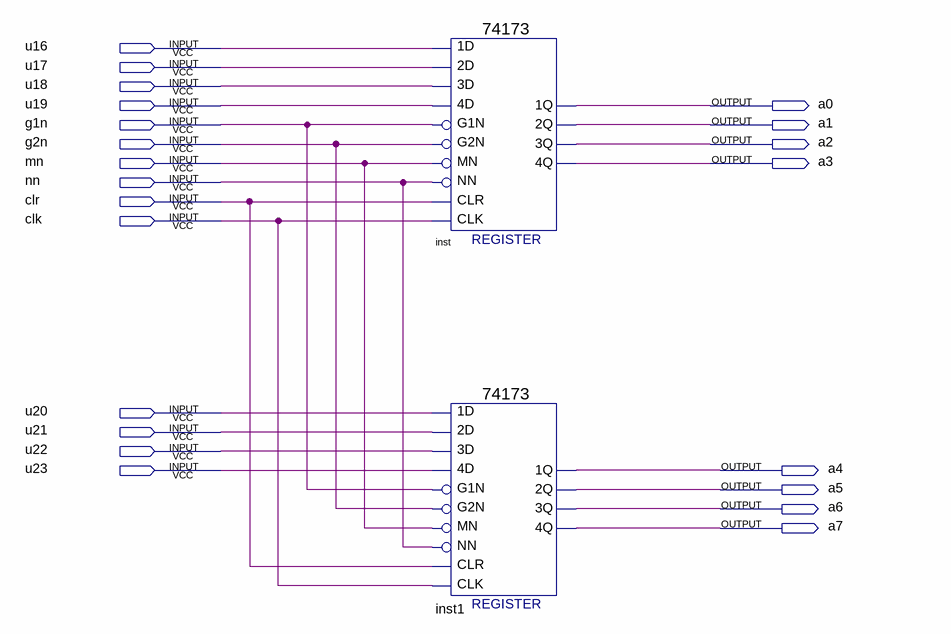
[diagram p0: schematic sheet]
// Quartus schematic register.bdf as structural Verilog: 2 symbols, 22 pins
module register (
  input  u16,
  input  u17,
  input  u18,
  input  u19,
  input  g1n,
  input  g2n,
  input  mn,
  input  nn,
  input  clr,
  input  clk,
  input  u20,
  input  u21,
  input  u22,
  input  u23,
  output a0,
  output a1,
  output a2,
  output a3,
  output a4,
  output a5,
  output a6,
  output a7
);

  \74173  inst (
    .\3D (u18), .MN(mn), .\1D (u16), .\2D (u17), .\4D (u19), .G1N(g1n), .G2N(g2n), .NN(nn), .CLR(clr),
    .CLK(clk), .\3Q (a2), .\2Q (a1), .\1Q (a0), .\4Q (a3));
  \74173  inst1 (
    .\3D (u22), .MN(mn), .\1D (u20), .\2D (u21), .\4D (u23), .G1N(g1n), .G2N(g2n), .NN(nn), .CLR(clr),
    .CLK(clk), .\3Q (a6), .\2Q (a5), .\1Q (a4), .\4Q (a7));
endmodule
